# Altium schematic sheet Sheet2.SchDoc
size A; SheetNumber: 1; SheetTotal: 1
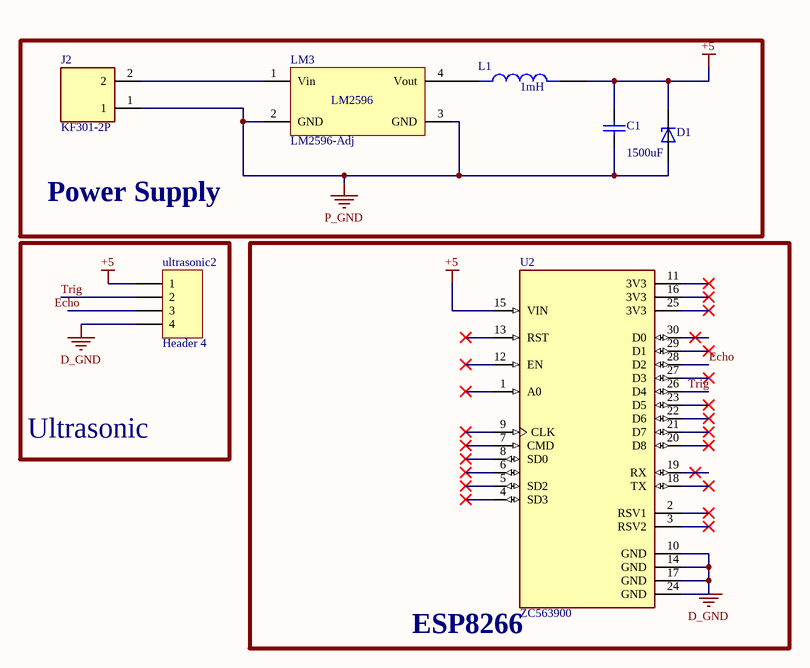
[diagram p0: Sheet2.SchDoc]

## Parts
C1  value 1500uF  [RAD-0.3]  (hidden comment: Cap)
D1  P6KE6.8A  [DIOAD1300W80L670D310]  (value not drawn)
J2  KF301-2P  [HANDSON_KF301-2P]
L1  value 1mH  [INDAD1680W80L1200D650]  (hidden comment: B82145A1474J000)
LM3  LM2596-Adj  [lm2596]
U2  ZC563900  [MODULE_ZC563900]
ultrasonic2  Header 4  [HDR1X4]

## Blocks framed on the sheet
Power Supply: C1 D1 J2 L1 LM3
Ultrasonic: ultrasonic2
ESP8266: U2

## Nets
+5: C1.2 D1.C L1.2 U2.15(VIN) ultrasonic2.1
D_GND: U2.10(GND) U2.14(GND) U2.17(GND) U2.24(GND) ultrasonic2.4
P_GND: C1.1 D1.A J2.1 LM3.2(GND) LM3.3(GND)
Echo: U2.28(D2) ultrasonic2.3
Trig: U2.26(D4) ultrasonic2.2
NetJ2_2: J2.2 LM3.1(Vin)
NetL1_1: L1.1 LM3.4(Vout)

Not connected (* = marked no-connect by the designer): U2 1(A0)* 2(RSV1)* 3(RSV2)* 4(SD3)* 5(SD2)* 6(SD1)* 7(CMD)* 8(SD0)* 9(CLK)* 11(3V3)* 12(EN)* 13(RST)* 16(3V3)* 18(TX)* 19(RX)* 20(D8)* 21(D7)* 22(D6)* 23(D5)* 25(3V3)* 27(D3)* 29(D1)* 30(D0)*

## Notes on the sheet
- (in symbol LM2596-Adj) LM2596

## Library data of the parts
C1 = Cap: Capacitor; Published: 8-Jun-2000; LatestRevisionDate: 17-Jul-2002; LatestRevisionNote: Re-released for DXP Platform.; PackageReference: RAD-0.3; Publisher: Altium Limited; PackageDescription: Radial Cap, Thru-Hole; 2 Leads; 0.3 in Pin Spacing
D1 = P6KE6.8A: 10.5V Clamp 58.1A Ipp Tvs Diode Through Hole DO-204AC (DO-15); MF: Littelfuse Inc.; SnapEDA_Link: https://www.snapeda.com/parts/P6KE6.8A/Littelfuse/view-part/?ref=snap; Package: DO-15 Littelfuse Inc.; Value: *; MP: P6KE6.8A; Check_prices: https://www.snapeda.com/parts/P6KE6.8A/Littelfuse/view-part/?ref=eda
J2 = KF301-2P: 2 Pin Terminal Block 5mm Pitch; MF: Handson Technology; SnapEDA_Link: https://www.snapeda.com/parts/KF301-2P/Handson+Technology/view-part/?ref=snap; Package: None; Value: *; MP: KF301-2P; Check_prices: https://www.snapeda.com/parts/KF301-2P/Handson+Technology/view-part/?ref=eda
L1 = B82145A1474J000: 470 ÂµH Unshielded Wirewound Inductor 510 mA 1.9Ohm Max Axial; MF: EPCOS; Price: None; Check_prices: https://www.snapeda.com/parts/B82145A1474J000/EPCOS/view-part/?ref=eda; Package: None; Purchase-URL: https://pricing.snapeda.com/search/part/B82145A1474J000/?ref=eda; Availability: In Stock; MP: B82145A1474J000; SnapEDA_Link: https://www.snapeda.com/parts/B82145A1474J000/EPCOS/view-part/?ref=snap
LM3 = LM2596-Adj: Designed By @Alixahedi
U2 = ZC563900: NodeMcu Lua ESP8266 WIFI Internet of Things Network Development Module Board; MF: YKS; Value: *; SnapEDA_Link: https://www.snapeda.com/parts/ZC563900/YKS/view-part/?ref=snap; Availability: Not in stock; Price: None; Package: None; Check_prices: https://www.snapeda.com/parts/ZC563900/YKS/view-part/?ref=eda; MP: ZC563900
ultrasonic2 = Header 4: Header, 4-Pin; LatestRevisionDate: 17-Jul-2002; LatestRevisionNote: Re-released for DXP Platform.; Publisher: Altium Limited